# EAGLE design Current Sense System_V2.2_0211_Final (EAGLE 9.5.2)
Copyright 2020 BU8 EE License Engineer: Mic.Tsai
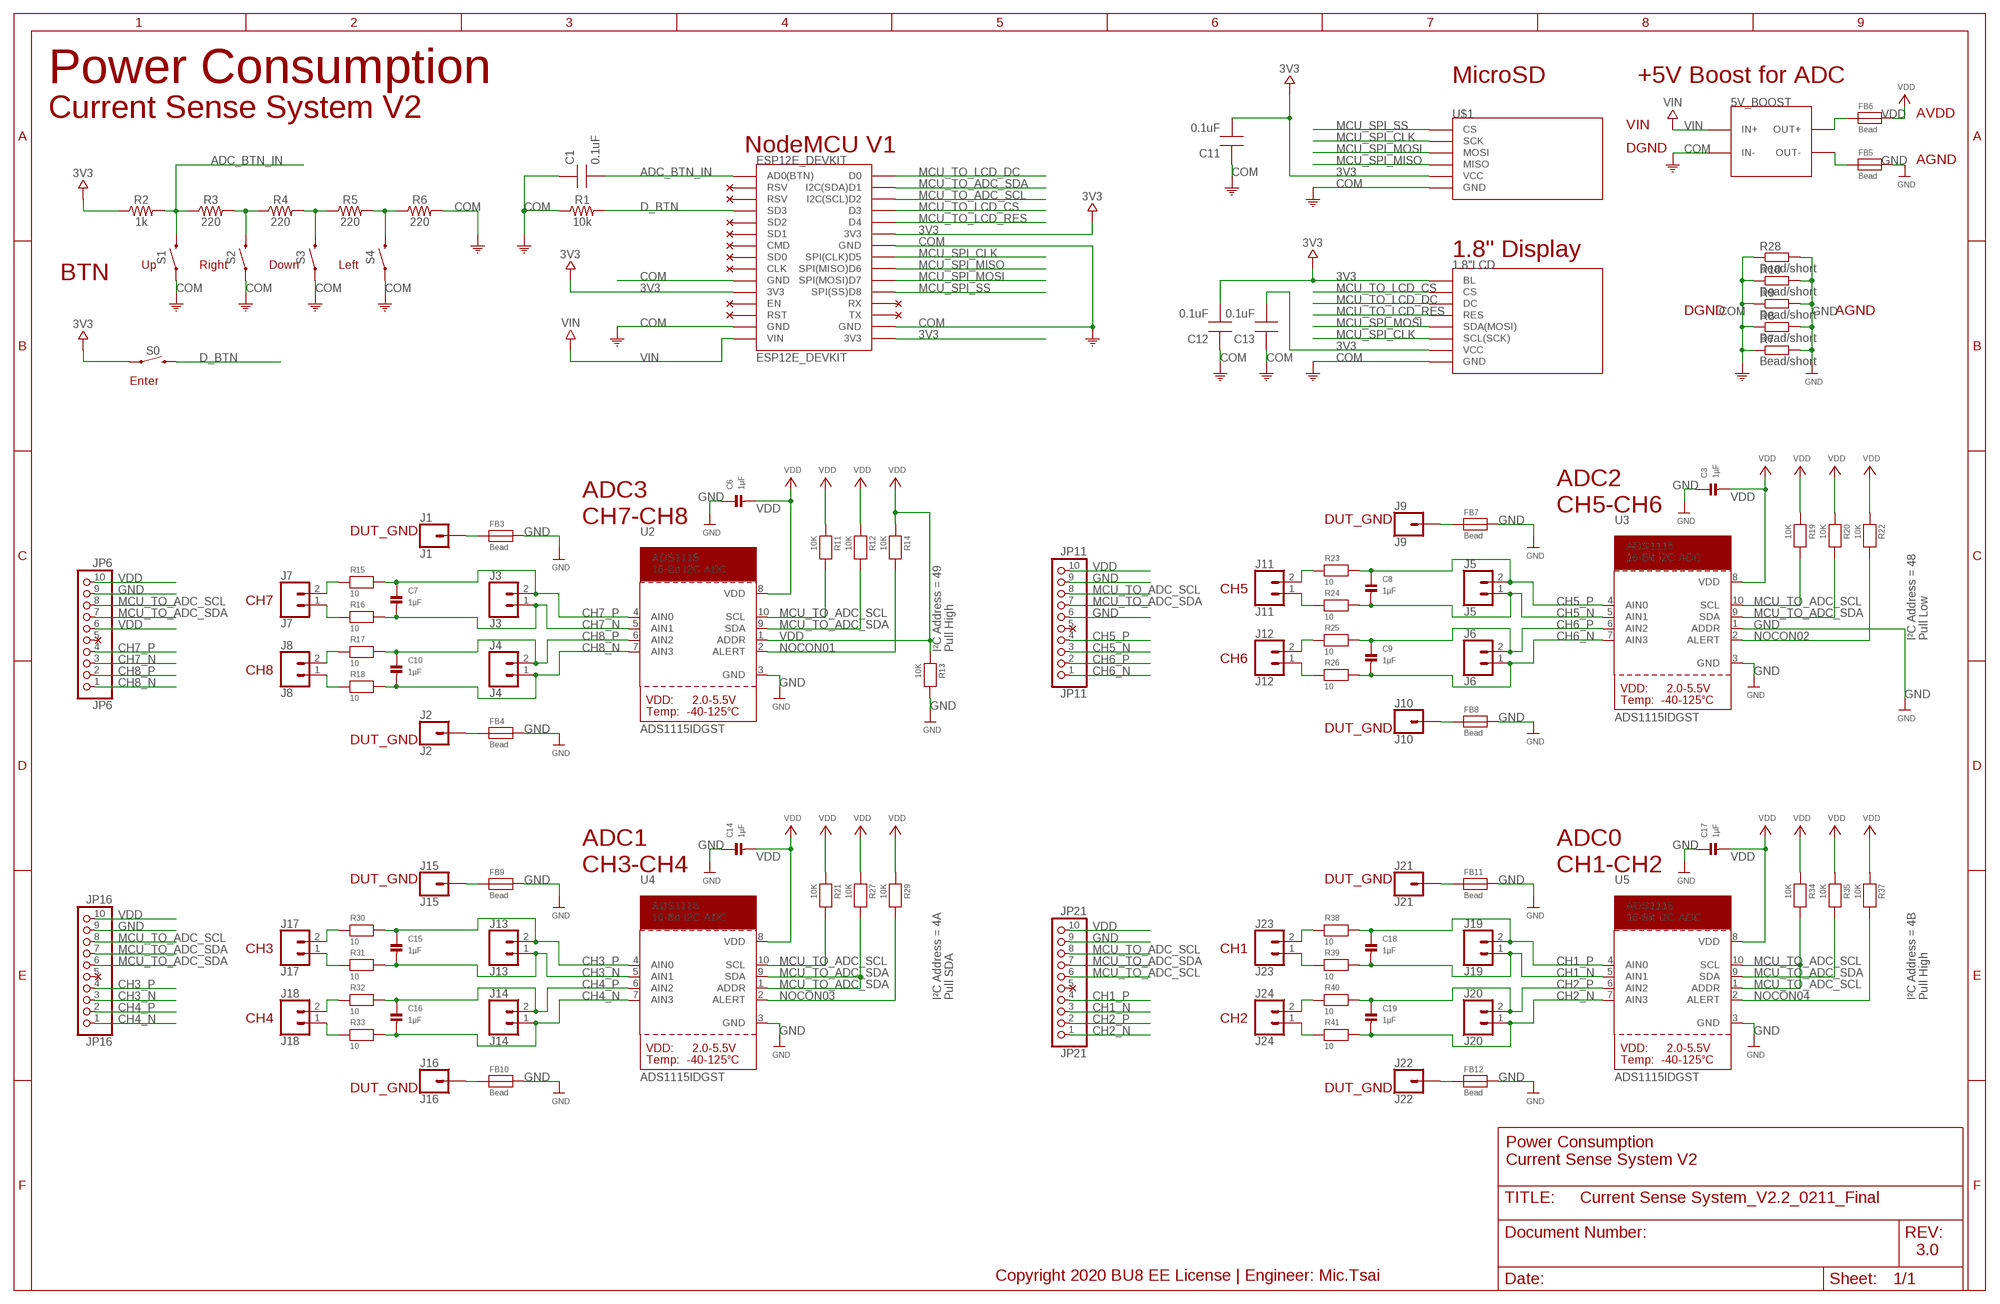
[diagram p0: schematic, sheet 1]

## Parts
1.8"LCD  1.8"LCD"  [1.8"LCD]
5V_BOOST  5VBOOST"  [5VBOOST]
C1  0.1uF  CAP0805-NP  [CAP0805-NP]
C3  1µF  CAP_CERAMIC0805  [0805]
C6  1µF  CAP_CERAMIC0805  [0805]
C7  1µF  CAP_CERAMIC0805  [0805]
C8  1µF  CAP_CERAMIC0805  [0805]
C9  1µF  CAP_CERAMIC0805  [0805]
C10  1µF  CAP_CERAMIC0805  [0805]
C11  0.1uF  CAP0805-NP  [CAP0805-NP]
C12  0.1uF  CAP0805-NP  [CAP0805-NP]
C13  0.1uF  CAP0805-NP  [CAP0805-NP]
C14  1µF  CAP_CERAMIC0805  [0805]
C15  1µF  CAP_CERAMIC0805  [0805]
C16  1µF  CAP_CERAMIC0805  [0805]
C17  1µF  CAP_CERAMIC0805  [0805]
C18  1µF  CAP_CERAMIC0805  [0805]
C19  1µF  CAP_CERAMIC0805  [0805]
ESP12E_DEVKIT  ESP12E_DEVKIT  [ESP12E_DEVKIT]
FB3  Bead  FERRITE0805  [0805]
FB4  Bead  FERRITE0805  [0805]
FB5  Bead  FERRITE0805  [0805]
FB6  Bead  FERRITE0805  [0805]
FB7  Bead  FERRITE0805  [0805]
FB8  Bead  FERRITE0805  [0805]
FB9  Bead  FERRITE0805  [0805]
FB10  Bead  FERRITE0805  [0805]
FB11  Bead  FERRITE0805  [0805]
FB12  Bead  FERRITE0805  [0805]
J1  J1  CONN_01  [1X01]
J2  J2  CONN_01  [1X01]
J3  J3  CONN_02  [1X02]
J4  J4  CONN_02  [1X02]
J5  J5  CONN_02  [1X02]
J6  J6  CONN_02  [1X02]
J7  J7  CONN_02  [1X02]
J8  J8  CONN_02  [1X02]
J9  J9  CONN_01  [1X01]
J10  J10  CONN_01  [1X01]
J11  J11  CONN_02  [1X02]
J12  J12  CONN_02  [1X02]
J13  J13  CONN_02  [1X02]
J14  J14  CONN_02  [1X02]
J15  J15  CONN_01  [1X01]
J16  J16  CONN_01  [1X01]
J17  J17  CONN_02  [1X02]
J18  J18  CONN_02  [1X02]
J19  J19  CONN_02  [1X02]
J20  J20  CONN_02  [1X02]
J21  J21  CONN_01  [1X01]
J22  J22  CONN_01  [1X01]
J23  J23  CONN_02  [1X02]
J24  J24  CONN_02  [1X02]
JP6  JP6  HEADER-1X1070MIL  [1X10_ROUND70]
JP11  JP11  HEADER-1X1070MIL  [1X10_ROUND70]
JP16  JP16  HEADER-1X1070MIL  [1X10_ROUND70]
JP21  JP21  HEADER-1X1070MIL  [1X10_ROUND70]
R1  10k  0.22OHM-0805-1/4W-1%  [0805]
R2  1k  0.22OHM-0805-1/4W-1%  [0805]
R3  220  0.22OHM-0805-1/4W-1%  [0805]
R4  220  0.22OHM-0805-1/4W-1%  [0805]
R5  220  0.22OHM-0805-1/4W-1%  [0805]
R6  220  0.22OHM-0805-1/4W-1%  [0805]
R7  Bead/short  R-EU_R0603  [R0603]
R8  Bead/short  R-EU_R0603  [R0603]
R9  Bead/short  R-EU_R0603  [R0603]
R10  Bead/short  R-EU_R0603  [R0603]
R11  10K  RESISTOR0805  [0805]
R12  10K  RESISTOR0805  [0805]
R13  10K  RESISTOR0805  [0805]
R14  10K  RESISTOR0805  [0805]
R15  10  RESISTOR0805  [0805]
R16  10  RESISTOR0805  [0805]
R17  10  RESISTOR0805  [0805]
R18  10  RESISTOR0805  [0805]
R19  10K  RESISTOR0805  [0805]
R20  10K  RESISTOR0805  [0805]
R21  10K  RESISTOR0805  [0805]
R22  10K  RESISTOR0805  [0805]
R23  10  RESISTOR0805  [0805]
R24  10  RESISTOR0805  [0805]
R25  10  RESISTOR0805  [0805]
R26  10  RESISTOR0805  [0805]
R27  10K  RESISTOR0805  [0805]
R28  Bead/short  R-EU_R0603  [R0603]
R29  10K  RESISTOR0805  [0805]
R30  10  RESISTOR0805  [0805]
R31  10  RESISTOR0805  [0805]
R32  10  RESISTOR0805  [0805]
R33  10  RESISTOR0805  [0805]
R34  10K  RESISTOR0805  [0805]
R35  10K  RESISTOR0805  [0805]
R37  10K  RESISTOR0805  [0805]
R38  10  RESISTOR0805  [0805]
R39  10  RESISTOR0805  [0805]
R40  10  RESISTOR0805  [0805]
R41  10  RESISTOR0805  [0805]
S0  MOMENTARY-SWITCH-SPST-PTH-6.0MM  [TACTILE_SWITCH_PTH_6.0MM]
S1  MOMENTARY-SWITCH-SPST-PTH-6.0MM  [TACTILE_SWITCH_PTH_6.0MM]
S2  MOMENTARY-SWITCH-SPST-PTH-6.0MM  [TACTILE_SWITCH_PTH_6.0MM]
S3  MOMENTARY-SWITCH-SPST-PTH-6.0MM  [TACTILE_SWITCH_PTH_6.0MM]
S4  MOMENTARY-SWITCH-SPST-PTH-6.0MM  [TACTILE_SWITCH_PTH_6.0MM]
U2  ADS1115IDGST  ADC_ADS1015  [MSOP10]
U3  ADS1115IDGST  ADC_ADS1015  [MSOP10]
U4  ADS1115IDGST  ADC_ADS1015  [MSOP10]
U5  ADS1115IDGST  ADC_ADS1015  [MSOP10]
U$1  MICROSD"  [MICROSD]

## Nets
3V3: 1.8"LCD.BL 1.8"LCD.VCC(3V3)(VCC) C11.2 C12.2 C13.2 ESP12E_DEVKIT.3V3@0(3V3) ESP12E_DEVKIT.3V3@1(3V3) ESP12E_DEVKIT.3V3@2(3V3) R2.1 S0.1 U$1.VCC(5V)(VCC)
ADC_BTN_IN: C1.2 ESP12E_DEVKIT.AD0(AD0(BTN)) R2.2 R3.1 S1.3
CH1_N: C18.2 J19.1 JP21.3 R39.2 U5.5(AIN1)
CH1_P: C18.1 J19.2 JP21.4 R38.2 U5.4(AIN0)
CH2_N: C19.2 J20.1 JP21.1 R41.2 U5.7(AIN3)
CH2_P: C19.1 J20.2 JP21.2 R40.2 U5.6(AIN2)
CH3_N: C15.2 J13.1 JP16.3 R31.2 U4.5(AIN1)
CH3_P: C15.1 J13.2 JP16.4 R30.2 U4.4(AIN0)
CH4_N: C16.2 J14.1 JP16.1 R33.2 U4.7(AIN3)
CH4_P: C16.1 J14.2 JP16.2 R32.2 U4.6(AIN2)
CH5_N: C8.2 J5.1 JP11.3 R24.2 U3.5(AIN1)
CH5_P: C8.1 J5.2 JP11.4 R23.2 U3.4(AIN0)
CH6_N: C9.2 J6.1 JP11.1 R26.2 U3.7(AIN3)
CH6_P: C9.1 J6.2 JP11.2 R25.2 U3.6(AIN2)
CH7_N: C7.2 J3.1 JP6.3 R16.2 U2.5(AIN1)
CH7_P: C7.1 J3.2 JP6.4 R15.2 U2.4(AIN0)
CH8_N: C10.2 J4.1 JP6.1 R18.2 U2.7(AIN3)
CH8_P: C10.1 J4.2 JP6.2 R17.2 U2.6(AIN2)
COM: 1.8"LCD.GND 5V_BOOST.IN- C1.1 C11.1 C12.1 C13.1 ESP12E_DEVKIT.GND@0(GND) ESP12E_DEVKIT.GND@1(GND) ESP12E_DEVKIT.GND@2(GND) ESP12E_DEVKIT.GND@3(GND) R1.1 R6.2 R7.1 R8.1 R9.1 R10.1 R28.1 S1.1 S2.1 S3.1 S4.1 U$1.GND
D_BTN: ESP12E_DEVKIT.SD3 R1.2 S0.3
GND: C3.1 C6.1 C14.1 C17.1 FB3.2 FB4.2 FB5.2 FB7.2 FB8.2 FB9.2 FB10.2 FB11.2 FB12.2 JP6.9 JP11.6 JP11.9 JP16.9 JP21.9 R7.2 R8.2 R9.2 R10.2 R13.2 R28.2 U2.3(GND) U3.1(ADDR) U3.3(GND) U4.3(GND) U5.3(GND)
MCU_SPI_CLK: 1.8"LCD.SCL(SCK) ESP12E_DEVKIT.D5(SPI(CLK)D5) U$1.SCK
MCU_SPI_MISO: ESP12E_DEVKIT.D6(SPI(MISO)D6) U$1.MISO
MCU_SPI_MOSI: 1.8"LCD.SDA(MOSI) ESP12E_DEVKIT.D7(SPI(MOSI)D7) U$1.MOSI
MCU_SPI_SS: ESP12E_DEVKIT.D8(SPI(SS)D8) U$1.CS
MCU_TO_ADC_SCL: ESP12E_DEVKIT.D2(I2C(SCL)D2) JP6.8 JP11.8 JP16.8 JP21.6 JP21.8 R11.2 R19.2 R21.2 R34.2 U2.10(SCL) U3.10(SCL) U4.10(SCL) U5.1(ADDR) U5.10(SCL)
MCU_TO_ADC_SDA: ESP12E_DEVKIT.D1(I2C(SDA)D1) JP6.7 JP11.7 JP16.6 JP16.7 JP21.7 R12.2 R20.2 R27.2 R35.2 U2.9(SDA) U3.9(SDA) U4.1(ADDR) U4.9(SDA) U5.9(SDA)
MCU_TO_LCD_CS: 1.8"LCD.CS ESP12E_DEVKIT.D3
MCU_TO_LCD_DC: 1.8"LCD.DC ESP12E_DEVKIT.D0
MCU_TO_LCD_RES: 1.8"LCD.RES ESP12E_DEVKIT.D4
N$3: FB3.1 J1.1
N$4: FB4.1 J2.1
N$6: J7.2 R15.1
N$7: J7.1 R16.1
N$11: J8.2 R17.1
N$12: J8.1 R18.1
N$13: 5V_BOOST.OUT- FB5.1
N$14: 5V_BOOST.OUT+ FB6.1
N$18: FB7.1 J9.1
N$19: FB8.1 J10.1
N$21: J11.2 R23.1
N$23: J11.1 R24.1
N$26: J12.2 R25.1
N$27: J12.1 R26.1
N$28: FB9.1 J15.1
N$29: R3.2 R4.1 S2.3
N$30: R4.2 R5.1 S3.3
N$31: R5.2 R6.1 S4.3
N$32: FB10.1 J16.1
N$34: J17.2 R30.1
N$36: J17.1 R31.1
N$39: J18.2 R32.1
N$40: J18.1 R33.1
N$41: FB11.1 J21.1
N$42: FB12.1 J22.1
N$44: J23.2 R38.1
N$46: J23.1 R39.1
N$49: J24.2 R40.1
N$50: J24.1 R41.1
NOCON01: R14.2 U2.2(ALERT)
NOCON02: R22.2 U3.2(ALERT)
NOCON03: R29.2 U4.2(ALERT)
NOCON04: R37.2 U5.2(ALERT)
VDD: C3.2 C6.2 C14.2 C17.2 FB6.2 JP6.6 JP6.10 JP11.10 JP16.10 JP21.10 R11.1 R12.1 R13.1 R14.1 R19.1 R20.1 R21.1 R22.1 R27.1 R29.1 R34.1 R35.1 R37.1 U2.1(ADDR) U2.8(VDD) U3.8(VDD) U4.8(VDD) U5.8(VDD)
VIN: 5V_BOOST.IN+ ESP12E_DEVKIT.VIN
Unconnected: ESP12E_DEVKIT.CLK ESP12E_DEVKIT.CMD ESP12E_DEVKIT.EN ESP12E_DEVKIT.RST ESP12E_DEVKIT.RSV@0(RSV) ESP12E_DEVKIT.RSV@1(RSV) ESP12E_DEVKIT.RX ESP12E_DEVKIT.SD0 ESP12E_DEVKIT.SD1 ESP12E_DEVKIT.SD2 ESP12E_DEVKIT.TX JP6.5 JP11.5 JP16.5 JP21.5

## Notes on the sheet
- Power Consumption | MicroSD | +5V Boost for ADC
- Current Sense System V2 | AVDD
- VIN
- NodeMCU V1 | DGND
- AGND
- 1.8" Display
- Up | Right | Down | Left
- BTN
- DGND | AGND
- Enter
- ADC2
  CH5-CH6
- ADC3
  CH7-CH8
- DUT_GND
- DUT_GND
- ADS1115
  16-Bit I2C ADC
- ADS1115
  16-Bit I2C ADC
- CH5
- CH7
- I²C Address = 48
  Pull Low
- I²C Address = 49
  Pull High
- CH6
- CH8
- DUT_GND
- DUT_GND
- ADC1
  CH3-CH4
- ADC0
  CH1-CH2
- DUT_GND | DUT_GND
- ADS1115
  16-Bit I2C ADC
- ADS1115
  16-Bit I2C ADC
- CH3 | CH1
- I²C Address = 4A
  Pull SDA
- I²C Address = 4B
  Pull High
- CH4 | CH2
- DUT_GND | DUT_GND
- Power Consumption
  Current Sense System V2
- 3.0
- Copyright 2020 BU8 EE License | Engineer: Mic.Tsai

## Library data of the parts
1.8"LCD = 1.8_LCD_v02:1.8"LCD: 1.8" 128x160 RGB TFT LCD
5V_BOOST = 5V_Boost:5VBOOST: 5VBOOST
C1 C11-C13 = MySMD:CAP0805-NP
C3 C6-C10 C14-C19 = microbuilder:CAP_CERAMIC: Ceramic Capacitors 0402 - 0402 Surface Mount Capacitors 16pF 50V 5% [Digikey: 445-4899-2-ND] 18pF 50V 5% [Digikey: 490-1281-2-ND] 22pF 50V 5% [Digikey: 490-1283-2-ND] 68pF 50V 5% [Digikey: 490-1289-2-ND] 0.1uF 10V 10% [Digikey: 490-1318-2-ND] 1.0uF 6.3V 10% [Digikey: 490-1320-2-ND] 0603 - 0603 Surface Mount Capacitors 16 pF 50V 5% [Digikey: 445-5051-2-ND] 22 pF 50V [Digikey: PCC220ACVTR-ND] 33 pF 50V 5% [Digikey: 490-1415-1-ND] 56pF 50V 5% [Digikey: 490-1421-1-ND] 220pF 50V 5% [Digikey: 445-1285-1-ND] 680 pF 50V 2200 pF 50V 5% C0G [Digikey: 445-1297-1-ND] 5600 pF 100V 5% X7R [Digikey: 478-3711-1-ND] 0.1 µF 25V 10% [Digikey: PCC2277TR-ND] 0.22 µF 16V 10% X7R [Digikey: 445-1318-1-ND] 1.0 µF 25V 10% [Digikey: 445-5146-2-ND] 0603 - RF Specific 3pF 250V +/-0.1pF RF [Digikey: 712-1347-1-ND] 18 pF 250V 5% [Digikey: 478-3505-1-ND or 712-1322-1-ND] 56 pF 250V 5% C0G RF [Digikey: 490-4867-1-ND] 68 pF 250V RF [Digikey: 490-4868-1-ND] 0805 - 0805 Surface Mount Capacitors 220 pF 250V 2% RF Ceramic Capacitor [Digikey: 712-1398-1-ND] 1000 pF 50V 2% NP0 Ceramic Capacitor [Digikey: 478-3760-1-ND] 0.1 µF 25V 10% Ceramic Capacitor [Digikey: PCC1828TR-ND] 1.0 µF 16V 10% Ceramic Capacitor[Digikey: 490-1691-2-ND] 10.0 µF 10V 10% Ceramic Capacitor[Digikey: 709-1228-1-ND] 10.0 uF 16V 10% Ceramic Capacitor [Digikey: 478-5165-2-ND] 47 uF 6.3V 20% Ceramic Capacitor [Digikey: 587-1779-1-ND or 399-5506-1-ND] 1206 - 1206 Surface Mount Capacitors 47uF 10V 20% Ceramic Capacitor [Digikey: 490-5528-1-ND or 399-5508-1-ND or 445-6010-1-ND] 100uF 6.3V -20%, +80% Y5V Ceramic Capacitor (Digikey: 490-4512-1-ND, Mouser: 81-GRM31CF50J107ZE1L)
ESP12E_DEVKIT = ESP12E_DEVKIT:ESP12E_DEVKIT: ESP12E DEVKIT BOARD
FB3-FB12 = microbuilder:FERRITE: Ferrite Bead 0603 MMZ1608B121C - 120 Ohm, 600mA Ferrite Chip - Digikey: 445-2164-1-ND BK1608HW121-T - 120 Ohm, 600mA Ferrite Chip - Digikey: 587-1876-2-ND 0805 HZ0805B272R-10 - 2.7K Ohm @ 100MHz, 200mA 0.8 Ohm DC Resistance - Digikey: 240-2504-1-ND (see also Murata BLM21BD272SN1L)
J1 J2 J9 J10 J15 J16 J21 J22 = SparkFun-Connectors:CONN_01: Single connection point. Often used as Generic Header-pin footprint for 0.1 inch spaced/style header connections On any of the 0.1 inch spaced packages, you can populate with these: Break Away Headers - Straight <https://www.sparkfun.com/products/116> (PRT-00116) Break Away Male Headers - Right Angle <https://www.sparkfun.com/products/553> (PRT-00553) Female Headers <https://www.sparkfun.com/products/115> (PRT-00115) Break Away Headers - Machine Pin <https://www.sparkfun.com/products/117> (PRT-00117) Break Away Female Headers - Swiss Machine Pin <https://www.sparkfun.com/products/743> (PRT-00743) This device is also useful as a general connection point to wire up your design to another part of your project. Our various solder wires solder well into these plated through hole pads. Hook-Up Wire - Assortment (Stranded, 22 AWG) <https://www.sparkfun.com/products/11375> (PRT-11375) Hook-Up Wire - Assortment (Solid Core, 22 AWG) <https://www.sparkfun.com/products/11367> (PRT-11367) View the entire wire category on our website here <https://www.sparkfun.com/categories/141> Special notes: SMTSO-256-ET is a "flush mount" nut for a 4-40 screw. We mostly use this on specialty testbeds; it is a nice way to connect hardware to your PCB at an adjustable hieght. Also note, the SNAP packages are for using a snappable style connector. We sell a baggie of snaps and they are also used on two LilyPad designs: Snap Assortment - 30 pack (male and female) <https://www.sparkfun.com/products/11347> (DEV-11347) LilyPad Arduino SimpleSnap <https://www.sparkfun.com/products/10941> (DEV-10941) LilyPad SimpleSnap Protoboard <https://www.sparkfun.com/products/10940> (DEV-10940)
J3-J8 J11-J14 J17-J20 J23 J24 = SparkFun-Connectors:CONN_02: Multi connection point. Often used as Generic Header-pin footprint for 0.1 inch spaced/style header connections On any of the 0.1 inch spaced packages, you can populate with these: Break Away Headers - Straight <https://www.sparkfun.com/products/116> (PRT-00116) Break Away Male Headers - Right Angle <https://www.sparkfun.com/products/553> (PRT-00553) Female Headers <https://www.sparkfun.com/products/115> (PRT-00115) Break Away Headers - Machine Pin <https://www.sparkfun.com/products/117> (PRT-00117) Break Away Female Headers - Swiss Machine Pin <https://www.sparkfun.com/products/743> (PRT-00743) For SCREWTERMINALS and SPRING TERMINALS visit here: Screw Terimnals on SparkFun.com <https://www.sparkfun.com/search/results?term=Screw+Terminals> (5mm/3.5mm/2.54mm spacing) This device is also useful as a general connection point to wire up your design to another part of your project. Our various solder wires solder well into these plated through hole pads. Hook-Up Wire - Assortment (Stranded, 22 AWG) <https://www.sparkfun.com/products/11375> (PRT-11375) Hook-Up Wire - Assortment (Solid Core, 22 AWG) <https://www.sparkfun.com/products/11367> (PRT-11367) View the entire wire category on our website here <https://www.sparkfun.com/categories/141> Special notes: Molex polarized connector foot print use with: PRT-08233 with associated crimp pins and housings. 2.54_SCREWTERM for use with PRT-10571. 3.5mm Screw Terminal footprints for PRT-08084 5mm Screw Terminal footprints for use with PRT-08432
JP6 JP11 JP16 JP21 = microbuilder:HEADER-1X10: PIN HEADER
R1-R6 = SparkFun-Resistors:0.22OHM: 0.22Ω resistor A resistor is a passive two-terminal electrical component that implements electrical resistance as a circuit element. Resistors act to reduce current flow, and, at the same time, act to lower voltage levels within circuits. - Wikipedia; PROD_ID: RES-09883; VALUE: 0.22
R7-R10 R28 = resistor:R-EU_: RESISTOR, European symbol
R11-R27 R29-R35 R37-R41 = microbuilder:RESISTOR: Resistors 0402 - 0402 Surface Mount Package 22 Ohm 1% 1/16W [Digikey: 311-22.0LRTR-ND] 33 Ohm 5% 1/16W 1.0K 5% 1/16W 1.5K 5% 1/16W 2.0K 1% 1/16W 10.0K 1% 1/16W [Digikey: 311-10.0KLRTR-ND] 10.0K 5% 1/16W [Digikey: RMCF0402JT10K0TR-ND] 12.1K 1% 1/16W [Digikey: 311-22.0LRTR-ND] 100.0K 5% 1/16W 0603 - 0603 Surface Mount Package 0 Ohm 1/10 Watt 1% Resistor 15 Ohm 1/10 Watt 1% Resistor 33 Ohm 1/10 Watt 1% Resistor 49.9 Ohm 1/10 Watt 1% Resistor 100 Ohm 1/10 Watt 1% Resistor 150 Ohm 1/10 Watt 1% Resistor 240 Ohm 1/10 Watt 1% Resistor 390 Ohm 1/10 Watt 1% Resistor 560 Ohm 1/10 Watt 1% Resistor 680 Ohm 1/10 Watt 1% Resistor 750 Ohm 1/10 Watt 1% Resistor 1.0K Ohm 1/10 Watt 1% Resistor 1.5K Ohm 1/10 Watt 1% Resistor 2.0K Ohm 1/10 Watt 1% Resistor 2.2K Ohm 1/10 Watt 1% Resistor 3.3K Ohm 1/10 Watt 1% Resistor 4.7K Ohm 1/10 Watt 1% Resistor 10.0K Ohm 1/10 Watt 1% Resistor 12.0K Ohm 1/10 Watt 1% Resistor 12.1K Ohm 1/10 Watt 1% Resistor 20.0K Ohm 1/10 Watt 1% Resistor 33.0K Ohm 1/10 Watt 1% Resistor 100.0K Ohm 1/10 Watt 1% Resistor 0805 - 0805 Surface Mount Package 0 Ohm 1/8 Watt 1% Resistor 33 Ohm 1/8 Watt 1% Resistor 100 Ohm 1/8 Watt 1% Resistor 150 Ohm 1/8 Watt 1% Resistor 200 Ohm 1/8 Watt 1% Resistor 240 Ohm 1/8 Watt 1% Resistor 330 Ohm 1/8 Watt 1% Resistor 390 Ohm 1/8 Watt 1% Resistor 470 Ohm 1/8 Watt 1% Resistor 1.0K Ohm 1/8 Watt 1% Resistor 1.5K Ohm 1/8 Watt 1% Resistor 2.0K Ohm 1/8 Watt 1% Resistor 4.7K Ohm 1/8 Watt 1% Resistor 5.1K Ohm 1/8 Watt 1% Resistor 5.6K Ohm 1/8 Watt 1% Resistor 10.0K Ohm 1/8 Watt 1% Resistor 22.0K Ohm 1/8 Watt 1% Resistor 33.0K Ohm 1/8 Watt 1% Resistor 100K Ohm 1/8 Watt 1% Resistor 1206 - 1206 Surface Mount Package 2012 - 2010 Surface Mount Package 0.11 Ohm 1/2 Watt 1% Resistor - Digikey: RHM.11UCT-ND
S0 S1-S4 = SparkFun-Switches:MOMENTARY-SWITCH-SPST: Momentary Switch (Pushbutton) - SPST Normally-open (NO) SPST momentary switches (buttons, pushbuttons). Variants PTH-12MM - 12mm square, through-hole Momentary Pushbutton Switch - 12mm Square <https://www.sparkfun.com/products/9190> (COM-09190) PTH-6.0MM, PTH-6.0MM-KIT - 6.0mm square, through-hole Mini Pushbutton Switch <https://www.sparkfun.com/products/97> (COM-00097) KIT package intended for soldering kit's - only one side of pads' copper is exposed. PTH-RIGHT-ANGLE-KIT - Right-angle, through-hole Right Angle Tactile Button <https://www.sparkfun.com/products/10791> - Used on SparkFun BigTime Watch Kit <https://www.sparkfun.com/products/11734> SMD-12MM - 12mm square, surface-mount Tactile Button - SMD (12mm) <https://www.sparkfun.com/products/12993> (COM-12993) Used on SparkFun PicoBoard <https://www.sparkfun.com/products/11888> SMD-4.5MM - 4.5mm Square Trackball Switch Used on SparkFun Blackberry Trackballer Breakout <https://www.sparkfun.com/products/13169> SMD-4.6MMX2.8MM - 4.60mm x 2.80mm, surface mount Used on SparkFun SAMD21 Mini Breakout <https://www.sparkfun.com/products/13664> SMD-5.2MM, SMD-5.2-REDUNDANT - 5.2mm square, surface-mount Mini Pushbutton Switch - SMD <https://www.sparkfun.com/products/8720> (COM-08720) Used on Arduino Pro Mini <https://www.sparkfun.com/products/11114> REDUNDANT package connects both switch circuits together SMD-6.0X3.5MM - 6.0 x 3.5mm, surface mount Momentary Reset Switch SMD <https://www.sparkfun.com/products/8229> (COM-08229) SMD-6.2MM-TALL - 6.2mm square, surface mount Tactile Button - SMD (6mm) <https://www.sparkfun.com/products/12992> Used on SparkFun Digital Sandbox <https://www.sparkfun.com/products/12651> SMD-RIGHT-ANGLE - Right-angle, surface mount Used on SparkFun Block for Intel® Edison - Arduino <https://www.sparkfun.com/products/13036>; PROD_ID: SWCH-08441; SF_SKU: COM-00097
U2-U5 = microbuilder:ADC_ADS1015: ADS1015 - 12-bit 4-Channel I2C ADC with Internal PGA VDD: 2.0-5.5V Sampling Rate: 3.3ksps Gain Settings: 2/3, 1, 2, 4, 8, 16 I2C Address: ADDR low = 1001000x, ADDR high = 1001001x Internal Comparator The ADS1015 includes an internal comparator that can be set to output a high-level on ALERT when the conversion results exceeeds a pre-defined upper level, and will deassert itself when the level falls below a pre-defined lower threshold level. It can also be set to windowed mode where the ALERT pin will be asserted if the data exceeds the upper threshold or falls below the lower threshold.
U$1 = MicroSD_Adapter:MICROSD: MicroSD_Adapter

## Board
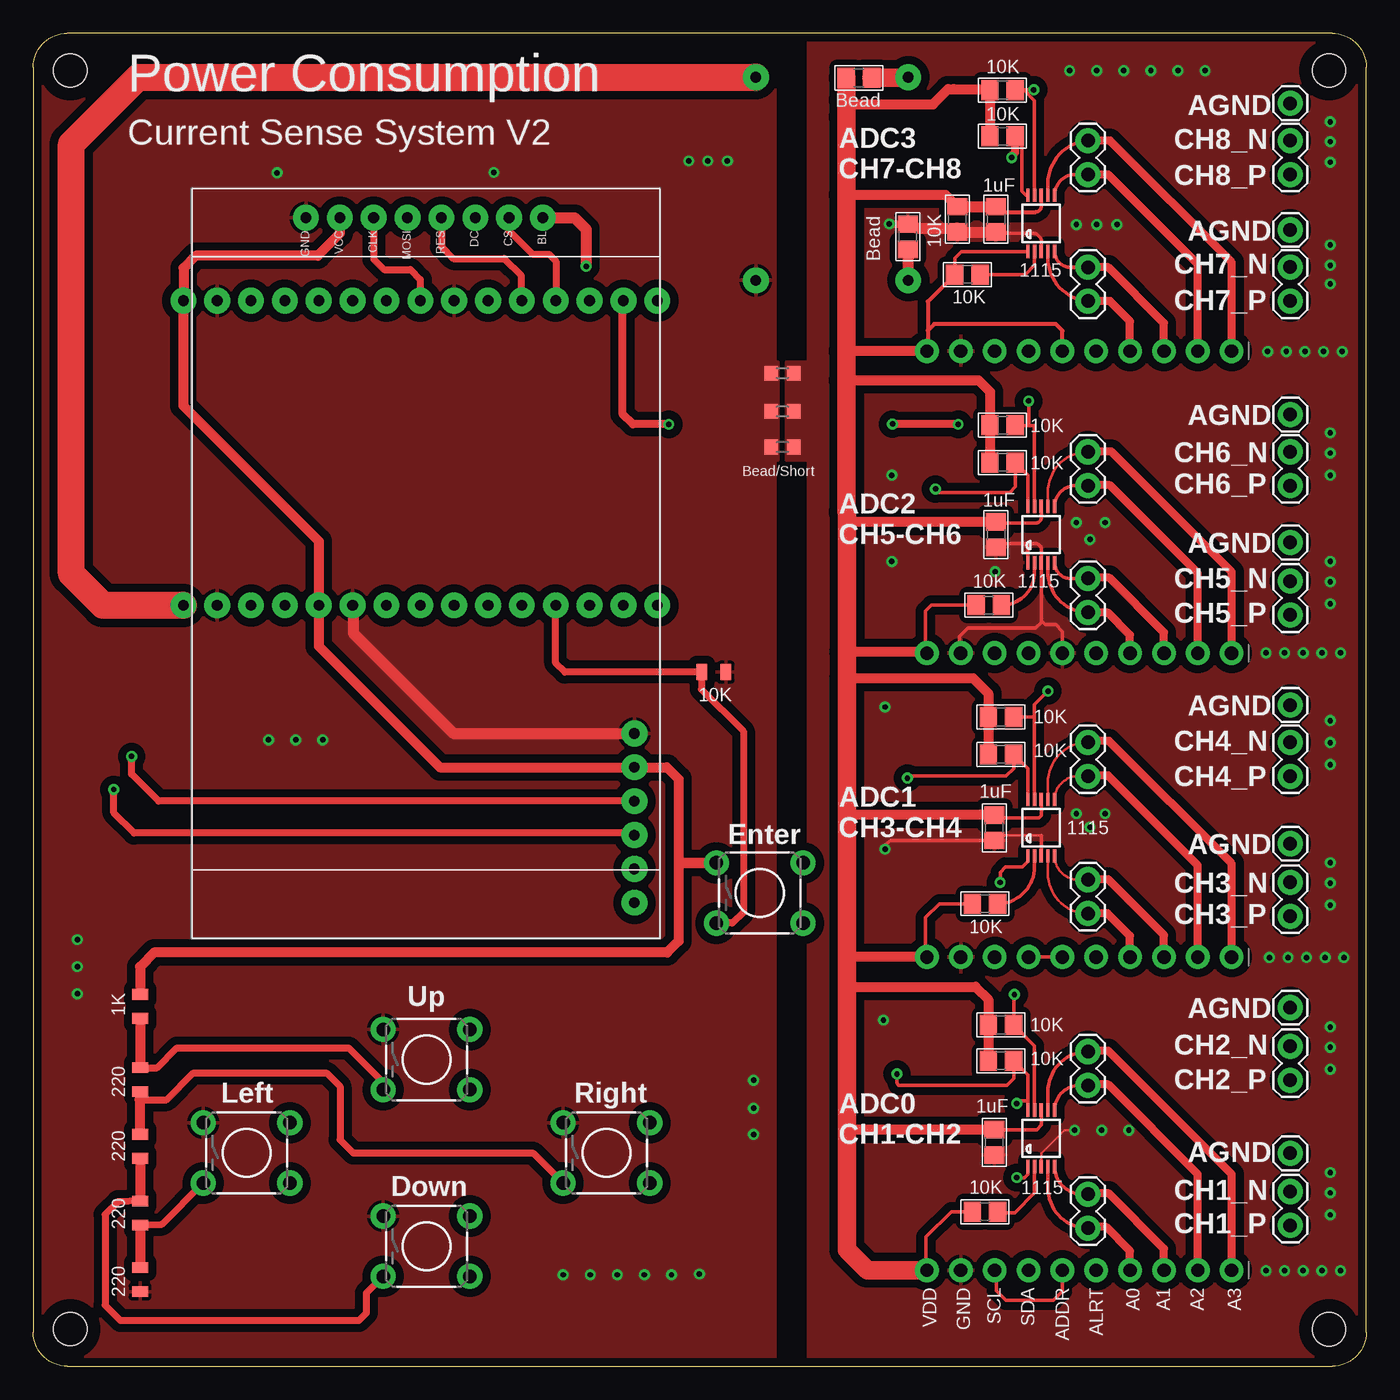
[diagram p1: board, top side]
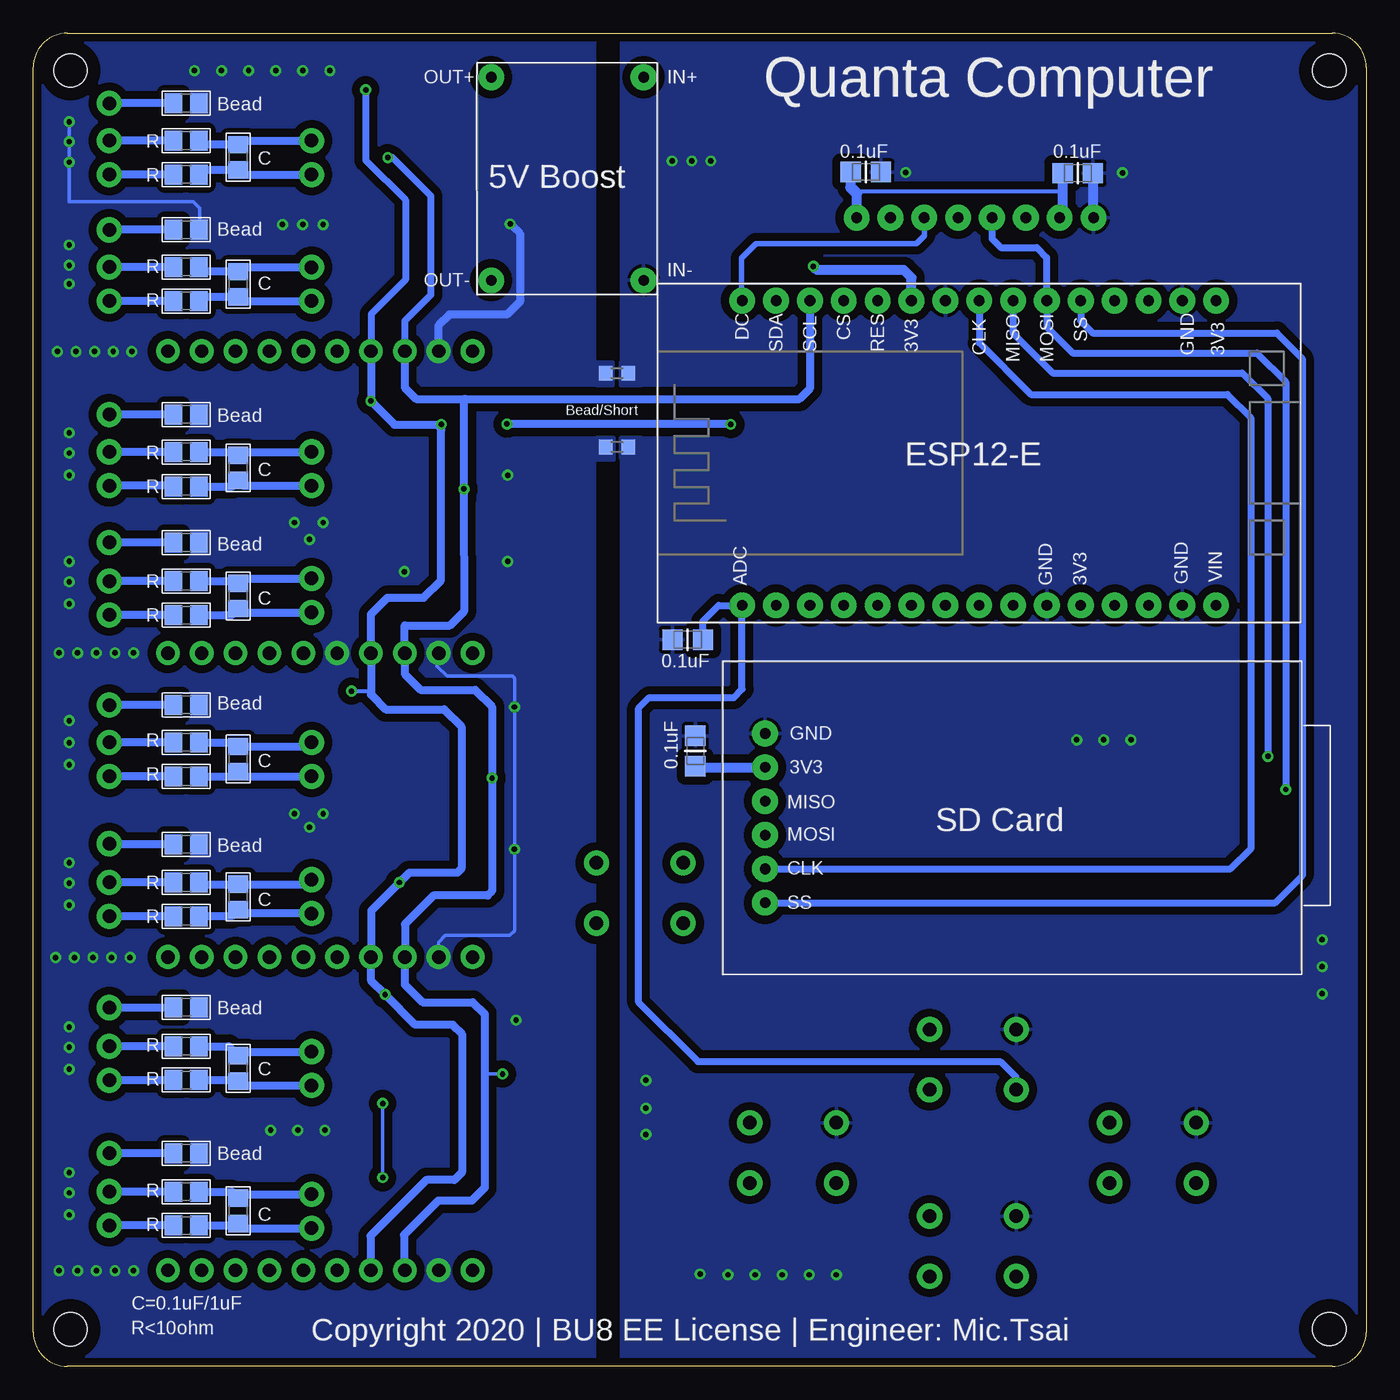
[diagram p2: board, bottom side, seen from below]

Size 100 x 100 mm. Coordinates in mm from the lower left corner, seen from the top.
Outline: 2.54,0 97.47,0 arc90 100,2.53 100,97.46 arc90 97.46,100 2.54,100 arc90 0,97.46 0,2.54 arc90 2.54,0
Copper layers (1*16): Top 0.035mm / dielectric 1.5mm / Bottom 0.035mm
Design rules "default *": minimum track width 8mil, minimum drill 16mil, track to track 4mil, track to pad 4mil, pad to pad 4mil, via to via 4mil, smd to smd 4mil, copper to edge 8mil, drill to drill 8mil, minimum pad ring 12mil, minimum via ring 8mil, stop-mask expansion 2mil, vias tented up to drill 4mil, thermal gap 10mil
Holes 2.5 mm at 2.77,97.21 2.77,2.79 97.21,2.77 97.21,97.21
tRestrict: area 1.3,95.7 to 4.3,98.7; area 1.3,1.3 to 4.3,4.3; area 95.7,1.3 to 98.7,4.3; area 95.7,95.7 to 98.7,98.7
bRestrict: area 1.3,95.7 to 4.3,98.7; area 1.3,1.3 to 4.3,4.3; area 95.7,1.3 to 98.7,4.3; area 95.7,95.7 to 98.7,98.7

### Footprints (pad centres in the part's own frame; a part is rotated, then mirrored left to right if it is on the bottom)
1.8"LCD = drill 0.8 pad 1.93: BL 7.93,26.74; CS 5.39,26.74; DC 2.85,26.74; GND -9.85,26.74; RES 0.31,26.74; SCL(SCK) -4.77,26.74; SDA(MOSI) -2.23,26.74; VCC(3V3) -7.31,26.74
5VBOOST = drill 0.8 pad 1.93: IN+ -7.31,7.69; IN- 7.93,7.69; OUT+ -7.31,-3.74; OUT- 7.93,-3.74
CAP0805-NP = smd 1.524 x 1.524: 1 0,0; 2 2.286,0
0805 = smd 1.3 x 1.5: 1 -0.95,0; 2 0.95,0
ESP12E_DEVKIT = drill 0.8 pad 1.93: 3V3@0 -11.43,-7.62; 3V3@1 11.43,5.08; 3V3@2 11.43,-17.78; AD0 -11.43,17.78; CLK -11.43,-2.54; CMD -11.43,2.54; D0 11.43,17.78; D1 11.43,15.24; D2 11.43,12.7; D3 11.43,10.16; D4 11.43,7.62; D5 11.43,0; D6 11.43,-2.54; D7 11.43,-5.08; D8 11.43,-7.62; EN -11.43,-10.16; GND@0 -11.43,-5.08; GND@1 -11.43,-15.24; GND@2 11.43,2.54; GND@3 11.43,-15.24; RST -11.43,-12.7; RSV@0 -11.43,15.24; RSV@1 -11.43,12.7; RX 11.43,-10.16; SD0 -11.43,0; SD1 -11.43,5.08; SD2 -11.43,7.62; SD3 -11.43,10.16; TX 11.43,-12.7; VIN -11.43,-17.78
1X01 = drill 1.016 pad 1.88: 1 0,0
1X02 = drill 1.016 pad 1.88: 1 0,0; 2 2.54,0
1X10_ROUND70 = drill 1 pad 1.778: 1 -11.43,0; 2 -8.89,0; 3 -6.35,0; 4 -3.81,0; 5 -1.27,0; 6 1.27,0; 7 3.81,0; 8 6.35,0; 9 8.89,0; 10 11.43,0
0805' = smd 0.8 x 1.2: 1 -0.9,0; 2 0.9,0
R0603 = smd 1 x 1.1: 1 -0.85,0; 2 0.85,0
TACTILE_SWITCH_PTH_6.0MM = drill 1.016 pad 1.88: 1 -3.251,2.261; 2 3.251,2.261; 3 -3.251,-2.261; 4 3.251,-2.261
MSOP10 = smd 0.25 x 1: 1 -1,-2.113; 2 -0.5,-2.113; 3 0,-2.113; 4 0.5,-2.113; 5 1,-2.113; 6 1,2.113; 7 0.5,2.113; 8 0,2.113; 9 -0.5,2.113; 10 -1,2.113
MICROSD = drill 0.8 pad 1.93: CS -4.77,6.42; GND 7.93,6.42; MISO 2.85,6.42; MOSI 0.31,6.42; SCK -2.23,6.42; VCC(5V) 5.39,6.42

### Placement (x,y rotation side)
1.8"LCD  30.3,59.42 0 top
5V_BOOST  61.9,89.4 270 bottom
C1  52.04,54.51 0 bottom
C3  72.22,62.4 90 top
C6  72.22,86.05 90 top
C7  84.63,81.16 90 bottom
C8  84.63,57.8 90 bottom
C9  84.63,67.4 90 bottom
C10  84.63,90.69 90 bottom
C11  50.33,47.3 270 bottom
C12  36.4,89.6 180 bottom
C13  20.5,89.5 180 bottom
C14  72.1,40.4 90 top
C15  84.63,35.2 90 bottom
C16  84.63,45.55 90 bottom
C17  72.1,16.8 90 top
C18  84.63,11.65 90 bottom
C19  84.63,22.35 90 bottom
ESP12E_DEVKIT  29.03,68.51 90 bottom
FB3  88.53,94.76 0 bottom
FB4  88.53,85.26 0 bottom
FB5  65.6,84.73 90 top
FB6  61.95,96.65 180 top
FB7  88.53,71.4 0 bottom
FB8  88.53,61.8 0 bottom
FB9  88.53,49.61 0 bottom
FB10  88.53,39.16 0 bottom
FB11  88.53,26.92 0 bottom
FB12  88.53,15.98 0 bottom
J1  94.3,94.75 0 top
J2  94.3,85.25 0 top
J3  79.12,82.45 270 top
J4  79.12,91.95 270 top
J5  79.12,59.1 270 top
J6  79.12,68.6 270 top
J7  94.3,82.46 270 top
J8  94.3,91.95 270 top
J9  94.3,71.4 0 top
J10  94.3,61.8 0 top
J11  94.3,58.9 270 top
J12  94.3,68.6 270 top
J13  79.12,36.5 270 top
J14  79.12,46.8 270 top
J15  94.3,49.6 0 top
J16  94.3,39.2 0 top
J17  94.3,36.3 270 top
J18  94.3,46.8 270 top
J19  79.12,12.9 270 top
J20  79.12,23.6 270 top
J21  94.3,26.9 0 top
J22  94.3,15.97 0 top
J23  94.3,13.1 270 top
J24  94.3,24 270 top
JP6  78.48,76.16 180 top
JP11  78.48,53.5 180 top
JP16  78.48,30.7 180 top
JP21  78.48,7.2 180 top
R1  10k  [0805']  51.05,52.07 180 top
R2  1k  [0805']  8,27 270 top
R3  220  [0805']  8,21.5 270 top
R4  220  [0805']  8,16.5 270 top
R5  220  [0805']  8,11.5 270 top
R6  220  [0805']  8,6.5 270 top
R7  56.21,74.5 0 top
R8  56.21,71.63 0 top
R9  56.21,68.96 0 top
R10  56.21,68.96 180 bottom
R11  72.72,92.27 0 top
R12  72.72,95.73 0 top
R13  69.32,86.05 270 top
R14  70.08,81.91 0 top
R15  88.53,79.92 0 bottom
R16  88.53,82.47 0 bottom
R17  88.53,89.41 0 bottom
R18  88.53,91.95 0 bottom
R19  72.72,67.8 0 top
R20  72.72,70.6 0 top
R21  72.6,45.91 0 top
R22  71.68,57.1 0 top
R23  88.53,56.35 0 bottom
R24  88.53,58.91 0 bottom
R25  88.53,66 0 bottom
R26  88.53,68.59 0 bottom
R27  72.6,48.71 0 top
R28  56.21,74.5 180 bottom
R29  71.4,34.7 0 top
R30  88.53,33.76 0 bottom
R31  88.53,36.29 0 bottom
R32  88.53,44.24 0 bottom
R33  88.53,46.8 0 bottom
R34  72.6,22.92 0 top
R35  72.6,25.61 0 top
R37  71.4,11.6 0 top
R38  88.53,10.56 0 bottom
R39  88.53,13.09 0 bottom
R40  88.53,21.48 0 bottom
R41  88.53,24.01 0 bottom
S0  54.5,35.5 0 top
S1  29.5,23 0 top
S2  43,16 0 top
S3  29.5,9 0 top
S4  16,16 0 top
U2  75.62,85.74 0 top
U3  75.62,62.4 0 top
U4  75.62,40.4 0 top
U5  75.62,17.1 0 top
U$1  38.68,39.54 90 bottom

### Tracks (layer width: path | path; a pad name or v marks a point on that pad's centre or on a via)
3V3  (via drill 0.41)
  Top 0.762: R2.1 8,29.97 9.07,31.04 47.55,31.04 48.41,31.9 48.41,37.77 S0.1 48.41,37.76 48.41,44.04 47.53,44.93 U$1.VCC(5V) 30.51,44.93 21.41,54.02 ESP12E_DEVKIT.3V3@0 21.41,61.9 11.25,72.06 ESP12E_DEVKIT.3V3@2 | 1.8"LCD.VCC(3V3) 22.99,84.97 21.34,83.31 12.19,83.31 11.28,82.4 11.28,79.92
  Top 0.813: v41.48,82.53 41.48,85.29 40.61,86.16 1.8"LCD.BL | ESP12E_DEVKIT.3V3@2 11.28,79.92
  Bottom 0.305: 22.79,88.11 38.35,88.11
  Bottom 0.762: C13.2 22.79,88.11 22.79,86.37 | ESP12E_DEVKIT.3V3@1 34.11,81.66 34.7,82.25 41.2,82.25 v41.48,82.53 | 50.25,44.93 U$1.VCC(5V) | C12.2 38.69,88.44 | 38.23,87.99 1.8"LCD.BL
  Bottom 0.813: 22.79,86.37 1.8"LCD.VCC(3V3) | C11.2 50.25,44.93 | 38.69,88.44 38.35,88.11 38.23,87.99
ADC_BTN_IN
  Top 0.508: R3.1 9.29,22.4 10.77,23.88 23.67,23.88 26.11,21.44 26.11,20.88 S1.3
  Top 0.762: R2.2 R3.1
  Bottom 0.508: S1.3 26.25,21.65 27.45,22.86 50.14,22.86 54.59,27.3 54.59,49.38 53.8,50.16 47.45,50.16 46.81,50.8 ESP12E_DEVKIT.AD0 48.58,57.08 49.76,55.91 C1.2
CH1_N
  Top 0.254: J19.1 78.71,12.9 arc-90 U5.5
  Top 0.61: JP21.3 84.83,8.82 80.7,12.95 79.18,12.95 J19.1
  Bottom 0.61: R39.2 85.12,13.09 C18.2 84.33,12.9 J19.1
CH1_P
  Top 0.254: J19.2 arc-90 76.12,13.36 U5.4
  Top 0.61: JP21.4 82.29,8.64 80.49,10.44 79.2,10.44 J19.2
  Bottom 0.61: R38.2 84.77,10.56 C18.1 84.29,10.36 J19.2
CH2_N
  Top 0.254: J20.1 arc90 76.12,20.6 U5.7
  Top 0.61: JP21.1 89.91,14.41 80.64,23.67 79.2,23.67 J20.1
  Bottom 0.61: R41.2 85.34,24.01 C19.2 84.33,23.6 J20.1
CH2_P
  Top 0.254: J20.2 78.47,21.06 arc90 U5.6
  Top 0.61: JP21.2 87.37,14.41 80.64,21.13 79.2,21.13 J20.2
  Bottom 0.61: R40.2 84.71,21.48 C19.1 84.3,21.06 J20.2
CH3_N
  Top 0.203: U4.5 arc90 78.41,36.5 J13.1
  Top 0.61: JP16.3 84.83,32.34 80.64,36.52 79.15,36.52 J13.1
  Bottom 0.61: R31.2 87.44,36.15 C15.2 79.47,36.15 J13.1
CH3_P
  Top 0.203: U4.4 76.12,36.96 arc90 J13.2
  Top 0.61: JP16.4 82.29,32.29 80.59,33.98 79.15,33.98 J13.2
  Bottom 0.61: R30.2 85.12,33.76 C15.1 84.37,33.98 79.15,33.98 J13.2
CH4_N
  Top 0.203: U4.7 76.12,43.8 arc-90 J14.1
  Top 0.61: JP16.1 89.91,37.7 80.7,46.91 79.24,46.91 J14.1
  Bottom 0.61: R33.2 84.93,46.8 C16.2 79.42,46.5 J14.1
CH4_P
  Top 0.203: U4.6 arc-90 78.37,44.26 J14.2
  Top 0.61: JP16.2 87.37,37.58 80.62,44.32 79.19,44.32 J14.2
  Bottom 0.61: R32.2 84.99,44.24 C16.1 84.29,44.26 J14.2
CH5_N
  Top 0.254: U3.5 arc90 77.81,59.1 J5.1
  Top 0.61: JP11.3 84.83,55.05 80.72,59.16 79.18,59.16 J5.1
  Bottom 0.61: R24.2 84.79,58.91 C8.2 84.28,59.1 J5.1
CH5_P
  Top 0.254: U3.4 76.12,59.56 arc90 J5.2
  Top 0.61: JP11.4 82.29,54.87 80.62,56.54 79.14,56.54 J5.2
  Bottom 0.61: R23.2 85.13,56.35 C8.1 84.34,56.56 J5.2
CH6_N
  Top 0.203: J6.1 arc90 76.12,65.6 U3.7
  Top 0.61: JP11.1 89.91,59.6 80.87,68.63 79.16,68.63 J6.1
  Bottom 0.61: R26.2 84.87,68.58 C9.2 84.38,68.6 J6.1
CH6_P
  Top 0.254: J6.2 78.17,66.06 arc90 U3.6
  Top 0.61: JP11.2 87.37,59.5 80.77,66.09 79.16,66.09 J6.2
  Bottom 0.61: R25.2 85.08,66 C9.1 84.24,66.06 J6.2
CH7_N
  Top 0.26: U2.5 arc90 77.8,82.45
  Top 0.305: 77.8,82.45 J3.1
  Top 0.61: JP6.3 84.83,78.27 80.64,82.45 J3.1
  Bottom 0.508: 87.58,82.11 R16.2
  Bottom 0.61: 87.58,82.11 C7.2 84.3,82.45 J3.1
CH7_P
  Top 0.26: U2.4 76.12,83.41 arc90 J3.2
  Top 0.61: JP6.4 82.29,78.39 80.77,79.91 J3.2
  Bottom 0.508: 84.63,79.9 C7.1 | 87.58,80.21 R15.2
  Bottom 0.61: C7.1 87.58,80.21 | 84.63,79.9 84.62,79.91 J3.2
CH8_N
  Top 0.254: J4.1 arc90 76.12,88.45
  Top 0.26: 76.12,88.45 U2.7
  Top 0.61: JP6.1 89.91,82.81 80.77,91.95 J4.1
  Bottom 0.508: 84.63,91.95 C10.2 | 87.58,91.64 R18.2
  Bottom 0.61: C10.2 87.58,91.64 | 84.63,91.95 J4.1
CH8_P
  Top 0.203: J4.2 78.18,89.41
  Top 0.254: 78.18,89.41 arc90 U2.6
  Top 0.61: JP6.2 87.37,82.69 80.64,89.41 J4.2
  Bottom 0.508: 87.58,89.74 R17.2
  Bottom 0.61: 87.58,89.74 C10.1 84.3,89.41 J4.2
COM  (via drill 0.41)
  Top 0.813: ESP12E_DEVKIT.GND@0 24,57.03 24,55 31.53,47.47 U$1.GND
  Bottom 0.762: C13.1 20.5,86.21
  Bottom 0.813: 20.5,86.21 1.8"LCD.GND
  other vias: 18.29,89.53 34.54,89.56 52.07,90.42 17.65,46.99 19.68,46.99 21.72,46.99 50.6,90.42 49.18,90.42 47.88,6.86 54.04,17.39 45.85,6.86 39.75,6.86 41.78,6.86 43.81,6.86 49.97,6.91 54.04,21.45 54.04,19.35 3.3,32 3.3,29.97 3.3,27.94
  pour Top (isolate 0.61): 0.25,0.25 0.25,99.75 55.63,99.75 55.63,0.25
  pour Bottom (isolate 0.61): 0.25,0.25 0.25,99.75 55.88,99.72 55.88,0.23
  pour Top (isolate 0.025, no thermals): 55.88,75.34 54.61,75.34 54.61,67.97 55.88,67.97
  pour Bottom (isolate 0.025, no thermals): 55.93,75.34 54.38,75.34 54.38,73.56 55.93,73.56
  pour Bottom (isolate 0.025, no thermals): 55.93,69.67 54.38,69.67 54.43,68.12 55.93,68.12
D_BTN
  Top 0.508: S0.3 52.44,33.24 53.26,34.06 53.26,47.65 50.13,50.79 50.13,52.05 R1.2 39.88,52.07 39.19,52.76 ESP12E_DEVKIT.SD3
GND  (via drill 0.41)
  Top 0.203: C14.1 72.46,39.81 75.62,39.81 | U5.3 75.64,15.01 75.64,15.98 77.37,17.7 v78.13,17.7
  Top 0.254: 74.17,61.72 75.18,61.72 arc-90 75.62,61.28 U3.3 75.62,55.95 | 74.17,61.72 72.5,61.72 arc90 C3.1 | U3.1 74.62,61.27 arc90 74.17,61.72 | 75.62,55.95 75.95,55.63 76.71,55.63 77.22,55.12 JP11.6 | 75.62,55.95 75.62,55.81 75.18,55.37 70.1,55.37 69.47,54.74 69.47,53.62 JP11.9 | 75.62,39.81 U4.3 | C14.1 64.34,39.45 64.03,39.22 63.91,39.09 v63.91,38.79 | U2.3 75.62,84.38 arc90 75,85 72.32,85 arc-90 C6.1
  Top 0.61: v64.22,85.7 FB5.2
  Top 0.813: C6.1 R13.2 69.3,85.1 69.3,85.2 69.31,85.38 66.2,85.38 66.2,85.4 FB5.2
  Bottom 0.254: JP16.9 69.59,31.81 69.09,32.31 64.26,32.31 63.91,32.66 v63.91,38.79 63.91,51.61 64.06,51.77 68.96,51.77 69.7,52.5 69.7,53.39 JP11.9 | v97.31,93.36 v97.31,91.87 97.31,87.38 88.01,87.38 87.5,86.87 87.5,85.34 FB4.2
  Bottom 0.61: v64.22,85.7 64,85.5 63.5,85 63.5,79.86 64.47,78.9 68.78,78.9 69.59,78.09 JP6.9
  other vias: 63.91,49.45 64.41,66.85 64.41,60.38 63.78,25.96 78.26,63.3 80.42,63.3 72.16,59.61 78.26,85.65 79.78,85.65 78.26,41.45 80.42,41.45 79.27,40.44 79.27,62.03 81.31,85.65 80.16,17.7 82.19,17.7 83.85,97.21 85.88,97.21 87.91,97.21 97.31,90.33 97.31,81.2 97.31,82.6 97.31,84.12 92.61,76.12 94.01,76.12 95.4,76.12 96.8,76.12 98.2,76.12 81.81,97.21 79.78,97.21 77.75,97.21 97.31,66.85 97.31,70.03 97.31,68.5 97.31,57.2 97.31,58.85 97.31,60.38 92.48,53.52 93.88,53.52 95.28,53.52 96.67,53.52 98.07,53.52 97.31,46.79 97.31,45.14 97.31,48.44 97.31,34.59 97.31,37.77 97.31,36.25 92.74,30.66 94.13,30.66 95.53,30.66 96.93,30.66 98.32,30.66 97.31,22.28 97.31,23.93 97.31,25.45 97.31,11.35 97.31,14.53 97.31,13 92.48,7.16 93.88,7.16 95.28,7.16 96.67,7.16 98.07,7.16
  pour Top (isolate 0.61): 58.17,0.25 58.17,68.83 56.52,68.83 56.52,74.68 58.17,74.68 58.17,99.75 99.75,99.75 99.75,0.25
  pour Bottom (isolate 0.61, no thermals): 57.91,0.25 57.91,68.07 56.57,68.07 56.57,75.26 57.91,75.26 57.91,99.75 99.5,99.75 99.5,0.25
  pour Bottom (isolate 0.025, no thermals): 57.76,75.34 56.49,75.34 56.49,73.56 57.76,73.58
  pour Bottom (isolate 0.025, no thermals): 57.76,69.67 56.41,69.67 56.41,68 57.76,68
  pour Top (isolate 0.025, no thermals): 58.06,75.34 56.52,75.34 56.52,68 58.01,68
MCU_SPI_CLK
  Top 0.508: 1.8"LCD.SCL(SCK) 25.53,83.05 26.31,82.27 28.3,82.27 29.03,81.53 ESP12E_DEVKIT.D5
  Bottom 0.508: ESP12E_DEVKIT.D5 29.03,76.78 25.15,72.9 10.41,72.9 8.64,71.12 8.64,38.86 10.19,37.31 U$1.SCK
MCU_SPI_MISO  (via drill 0.41)
  Top 0.508: U$1.MISO 9.41,42.39 7.38,44.42 v7.38,45.75
  Bottom 0.508: ESP12E_DEVKIT.D6 26.49,77.49 23.52,74.52 9.3,74.52 7.4,72.62 7.4,45.75 v7.38,45.75
MCU_SPI_MOSI  (via drill 0.41)
  Top 0.508: U$1.MOSI 44.95,40 7.56,40 6.03,41.52 v6.03,43.27
  Bottom 0.508: 1.8"LCD.SDA(MOSI) 28.07,84.59 27.41,83.92 24.71,83.92 23.98,83.19 23.98,79.97 | ESP12E_DEVKIT.D7 23.95,77.95 22.02,76.02 8.19,76.02 6.03,73.86 v6.03,43.27
  Bottom 0.813: 23.98,79.97 ESP12E_DEVKIT.D7
MCU_SPI_SS
  Bottom 0.508: ESP12E_DEVKIT.D8 21.41,78.41 20.51,77.51 6.7,77.51 4.79,75.6 4.79,36.8 6.83,34.77 U$1.CS
MCU_TO_ADC_SCL  (via drill 0.41)
  Top 0.254: U3.10 74.62,66.85 R19.2 73.67,65.98 73.25,65.56 67.94,65.56 v67.69,65.81 | JP21.6 77.21,5.6 76.53,4.93 72.97,4.93 72.24,5.66 72.24,7.09 JP21.8 | U4.10 74.62,44.83 R21.2 73.55,44.85 72.97,44.27 65.73,44.27 v65.58,44.12 | v64.8,21.92 64.8,21.29 64.82,21.18 64.92,21.08 73.05,21.08 73.55,21.58 R34.2 74.62,21.84 U5.10 74.62,19.28 74.62,19.89 74,19.89 v73.79,19.71 | U2.10 74.45,87.86 74.17,88.14 74.17,91.77 R11.2 73.66,92.2 | v73.41,90.68 73.41,90.81 | U5.1 74.62,14.4 74.37,14.15 v73.79,14.15
  Top 0.61: 73.66,92.2 73.66,91.06 73.41,90.81
  Bottom 0.254: 66.14,21.95 64.82,21.95 v64.8,21.92 | v73.79,14.15 v73.79,19.71
  Bottom 0.508: v73.41,90.68 73.05,90.68 70.18,87.81 70.18,80.37 72.14,78.41 72.14,76.17 JP6.8
  Bottom 0.61: JP6.8 72.13,73.42 71.27,72.57 67.64,72.57 | 67.64,72.57 42.52,72.57 41.73,73.35 ESP12E_DEVKIT.D2 | JP21.8 72.19,7.26 72.19,9.86 69.62,12.42 67.11,12.42 66.14,13.39 66.14,21.95 66.14,26.42 67.03,27.3 70.79,27.3 72.13,28.64 JP16.8 72.11,30.72 72.11,33.17 69.98,35.31 65.91,35.31 65.58,35.64 v65.58,44.12 65.58,49.48 66.85,50.75 70.94,50.75 72.13,51.93 JP11.8 72.13,55.56 72.11,55.58 68.73,55.58 67.69,56.62 67.72,65.02 67.69,65.05 v67.69,65.81 67.69,72.52 67.64,72.57
MCU_TO_ADC_SDA  (via drill 0.41)
  Top 0.254: JP16.6 JP16.7 | U3.9 75.12,70.56 74.68,70.56 | 74.68,70.56 73.71,70.56 R20.2 | 74.68,70.56 v74.68,72.42 | U4.9 75.12,48.66 | 75.12,48.66 75.07,48.71 R27.2 | 75.12,48.66 75.12,49.65 v76.12,50.65 | U4.1 74.62,37.88 74.19,37.45 72.93,37.45 72.54,37.06 v72.54,36.3 | U5.9 75.12,24.03 R35.2 73.56,25.73 73.56,27.81 73.61,27.86 v73.61,27.89 | U2.9 75.12,94.94 74.31,95.75 | 74.31,95.75 73.7,95.75 R12.2 | v75.06,95.76 v75.05,95.75 74.31,95.75
  Top 0.61: v69.39,70.66 64.49,70.66 v64.47,70.69 | v47.68,70.66 44.98,70.66 44.22,71.42 44.22,79.89 ESP12E_DEVKIT.D1
  Bottom 0.254: v74.68,72.42 74.67,72.41 | v72.54,36.3 72.53,36.28 | v73.61,27.89 73.62,27.88
  Bottom 0.305: v76.12,50.65 74.93,50.65 74.67,50.38
  Bottom 0.508: v75.06,95.76 75.06,90.47 72.08,87.5 72.08,81.51 74.65,78.94 74.65,76.18 JP6.7
  Bottom 0.61: JP6.7 74.67,72.41 72.9,70.64 69.7,70.64 69.42,70.36 69.42,70.23 | 69.42,70.23 69.42,58.95 70.71,57.66 73.43,57.66 74.67,56.42 JP11.7 74.67,50.38 73.56,49.28 69.16,49.28 67.87,47.98 67.87,37.34 68.2,37.01 71.81,37.01 72.53,36.28 74.65,34.16 74.65,30.72 JP16.7 74.65,30.68 74.65,28.91 73.62,27.88 71.35,25.61 68.53,25.61 67.84,24.92 67.84,14.53 68.4,13.97 70.51,13.97 74.7,9.78 74.7,7.24 JP21.7 | v69.39,70.66 69.39,70.26 69.42,70.23 | v64.47,70.69 64.47,70.66 v47.68,70.66
MCU_TO_LCD_CS
  Top 0.508: 1.8"LCD.CS 35.69,85.19 37.47,83.41 38.71,83.41 39.22,82.91 39.22,79.97
  Top 0.813: 39.22,79.97 ESP12E_DEVKIT.D3
MCU_TO_LCD_DC
  Bottom 0.406: 1.8"LCD.DC 33.15,84.83 33.76,84.23 45.77,84.23 46.86,83.13 46.86,79.99 ESP12E_DEVKIT.D0
MCU_TO_LCD_RES
  Top 0.508: 1.8"LCD.RES 30.61,83.99 31.5,83.11 35.33,83.11 36.58,81.86 36.58,80.02
  Top 0.813: 36.58,80.02 ESP12E_DEVKIT.D4
N$3
  Bottom 0.61: FB3.1 93.27,94.76 J1.1
N$4
  Bottom 0.61: FB4.1 J2.1
N$6
  Bottom 0.61: R15.1 J7.2
N$7
  Bottom 0.61: R16.1 94.29,82.47 J7.1
N$11
  Bottom 0.61: R17.1 J8.2
N$12
  Bottom 0.61: R18.1 93.32,91.95 J8.1
N$13
  Top 0.813: FB5.1 65.6,81.51 5V_BOOST.OUT-
N$14
  Top 1.397: 5V_BOOST.OUT+ 65.58,96.65 FB6.1
N$18
  Bottom 0.61: FB7.1 J9.1
N$19
  Bottom 0.61: FB8.1 J10.1
N$21
  Bottom 0.61: R23.1 J11.2
N$23
  Bottom 0.61: R24.1 J11.1
N$26
  Bottom 0.61: R25.1 89.53,66.06 J12.2
N$27
  Bottom 0.61: R26.1 94.28,68.58 J12.1
N$28
  Bottom 0.61: FB9.1 94.29,49.61 J15.1
N$29
  Top 0.508: 8,20 10,20 12,22 22,22 23,21 23,17 24,16 37.49,16 S2.3
  Top 0.762: R4.1 8,20
  Top 0.813: R3.2 8,20
N$30
  Top 0.508: R5.1 6.35,12.35 5.38,11.38 5.38,4.58 6.53,3.43 24.43,3.43 25,4 25,5.49 S3.3
  Top 0.762: R4.2 R5.1
N$31
  Top 0.508: R5.2 9.66,10.65 S4.3
  Top 0.762: R5.2 R6.1
N$32
  Bottom 0.61: FB10.1 94.26,39.16 J16.1
N$34
  Bottom 0.61: R30.1 J17.2
N$36
  Bottom 0.61: R31.1 J17.1
N$39
  Bottom 0.61: R32.1 94.28,44.24 J18.2
N$40
  Bottom 0.61: R33.1 J18.1
N$41
  Bottom 0.61: FB11.1 89.5,26.9 J21.1
N$42
  Bottom 0.61: FB12.1 94.29,15.98 J22.1
N$44
  Bottom 0.61: R38.1 J23.2
N$46
  Bottom 0.61: R39.1 94.29,13.09 J23.1
N$49
  Bottom 0.61: R40.1 89.5,21.46 J24.2
N$50
  Bottom 0.61: R41.1 J24.1
NOCON01
  Top 0.254: R14.2 74.44,81.91 75.12,82.59 75.12,83.61 75.12,83.62 U2.2
NOCON02
  Top 0.254: R22.2 arc90 75.12,59.59 U3.2
NOCON03
  Top 0.254: R29.2 arc90 75.12,37.47 U4.2
NOCON04
  Top 0.254: U5.2 75.12,13 73.64,11.51 72.44,11.51 R37.2
VDD
  Top 0.203: 61.04,51.48 61.27,51.48 61.32,51.44 61.08,51.44 61.04,51.48 | 61.04,51.48 61.04,51.61 | R21.1 71.88,45.68 71.88,45.44 71.65,45.67 R21.1
  Top 0.254: 75.2,86.6 arc90 75.62,87.02 U2.8 | U3.8 75.62,63.69 arc-90 75.18,63.25 72.33,63.25 C3.2 | U4.8 75.62,41.33 75.44,41.15 72.3,41.15 C14.2 | R29.1 67.97,34.7 66.93,33.66 66.93,30.82 JP16.10 | R22.1 67.39,57.1 66.93,56.64 66.93,53.62 JP11.10 | C17.2 75.28,17.75 75.64,18.11 75.64,19.2 U5.8 | R37.1 68.88,11.6 66.98,9.7 66.98,7.27 JP21.10 | U2.1 69.63,83.63 69.13,83.13 R14.1 | 61.75,63.35 61.04,64.06 60.99,64.11
  Top 0.305: 61,95 61.32,94.68 | C6.2 arc90 72.62,86.6 75.2,86.6 | JP6.6 77.21,77.69 76.7,78.2 67.6,78.2 67.1,77.7 | 67.1,77.7 67.1,76.22 JP6.10 | R14.1 67.1,79.87 67.1,77.7
  Top 0.762: JP6.10 61,76.16 | R19.1 R20.1 71.77,73.11 70.92,73.97 60.99,73.97 | 66.95,53.59 61.04,53.59 | C3.2 61.75,63.35 | R11.1 R12.1 71.69,95.81 69.04,95.81 69.03,95.81 68.64,95.81 67.5,94.68 61.32,94.68 | 61.04,51.61 70.51,51.61 71.65,50.47 R27.1 R21.1 | JP16.10 61.1,30.7 61.04,30.76 | 61.04,28.47 70.69,28.47 71.65,27.51 R35.1 R34.1 | C17.2 61.21,17.75 61.04,17.58 | C14.2 61.29,41.35 61.04,41.6 | 60.99,87.88 68.44,87.88 R13.1
  Top 0.813: R13.1 C6.2
  Top 1.27: JP11.10 arc90 66.95,53.59
  Top 1.397: FB6.2 61,95 61,93.74 60.99,93.75 60.99,87.88 60.99,76.15 | 60.99,76.15 60.99,73.97 60.99,64.11 | 61.04,64.06 61.04,53.59 61.04,51.61 | 61,76.16 60.99,76.15 | JP21.10 62.58,7.2 61.04,8.74 61.04,17.58 61.04,28.47 61.04,30.76 61.04,41.6 61.04,51.48
VIN
  Top 2.032: ESP12E_DEVKIT.VIN 5.22,57.08 2.85,59.46 2.85,91.68 7.83,96.67 54.17,96.67 5V_BOOST.IN+

### Text on the board
tPlace: 10K | Power Consumption | Bead | AGND | 10K | Current Sense System V2 | CH8_N | ADC3 / CH7-CH8 | CH8_P | 1uF | GND | VCC | CLK | MOSI | RES | DC | CS | BL | 10K | AGND | Bead | 1115 | CH7_N | 10K | CH7_P | AGND | 10K | CH6_N | Bead/Short | 10K | CH6_P | 1uF | ADC2 / CH5-CH6 | AGND | 10K | 1115 | CH5_N | CH5_P | 10K | AGND | 10K | 10K | CH4_N | 1uF | CH4_P | ADC1 / CH3-CH4 | 1115 | Enter | AGND | CH3_N | CH3_P | 10K | Up | 1K | AGND | 10K | 10K | CH2_N | CH2_P | 220 | Left | Right | 1uF | ADC0 / CH1-CH2 | 220 | AGND | Down | 10K | 1115 | CH1_N | 220 | CH1_P | VDD | GND | SCL | SDA | ADDR | ALRT | A0 | A1 | A2 | A3 | 220
bPlace: IN+ | OUT+ | Quanta Computer | Bead | 0.1uF | 0.1uF | R | C | R | 5V Boost | Bead | IN- | R | OUT- | C | R | SS | CS | DC | 3V3 | GND | CLK | 3V3 | RES | SCL | SDA | MOSI | MISO | Bead/Short | Bead | ESP12-E | R | C | R | Bead | VIN | GND | 3V3 | GND | ADC | R | C | R | 0.1uF | Bead | 0.1uF | GND | R | C | 3V3 | R | MISO | SD Card | MOSI | Bead | CLK | R | C | SS | R | Bead | R | C | R | Bead | R | C | R | C=0.1uF/1uF | Copyright 2020 | BU8 EE License | Engineer: Mic.Tsai | R<10ohm